# Altium project PCB_Project2.PrjPCB
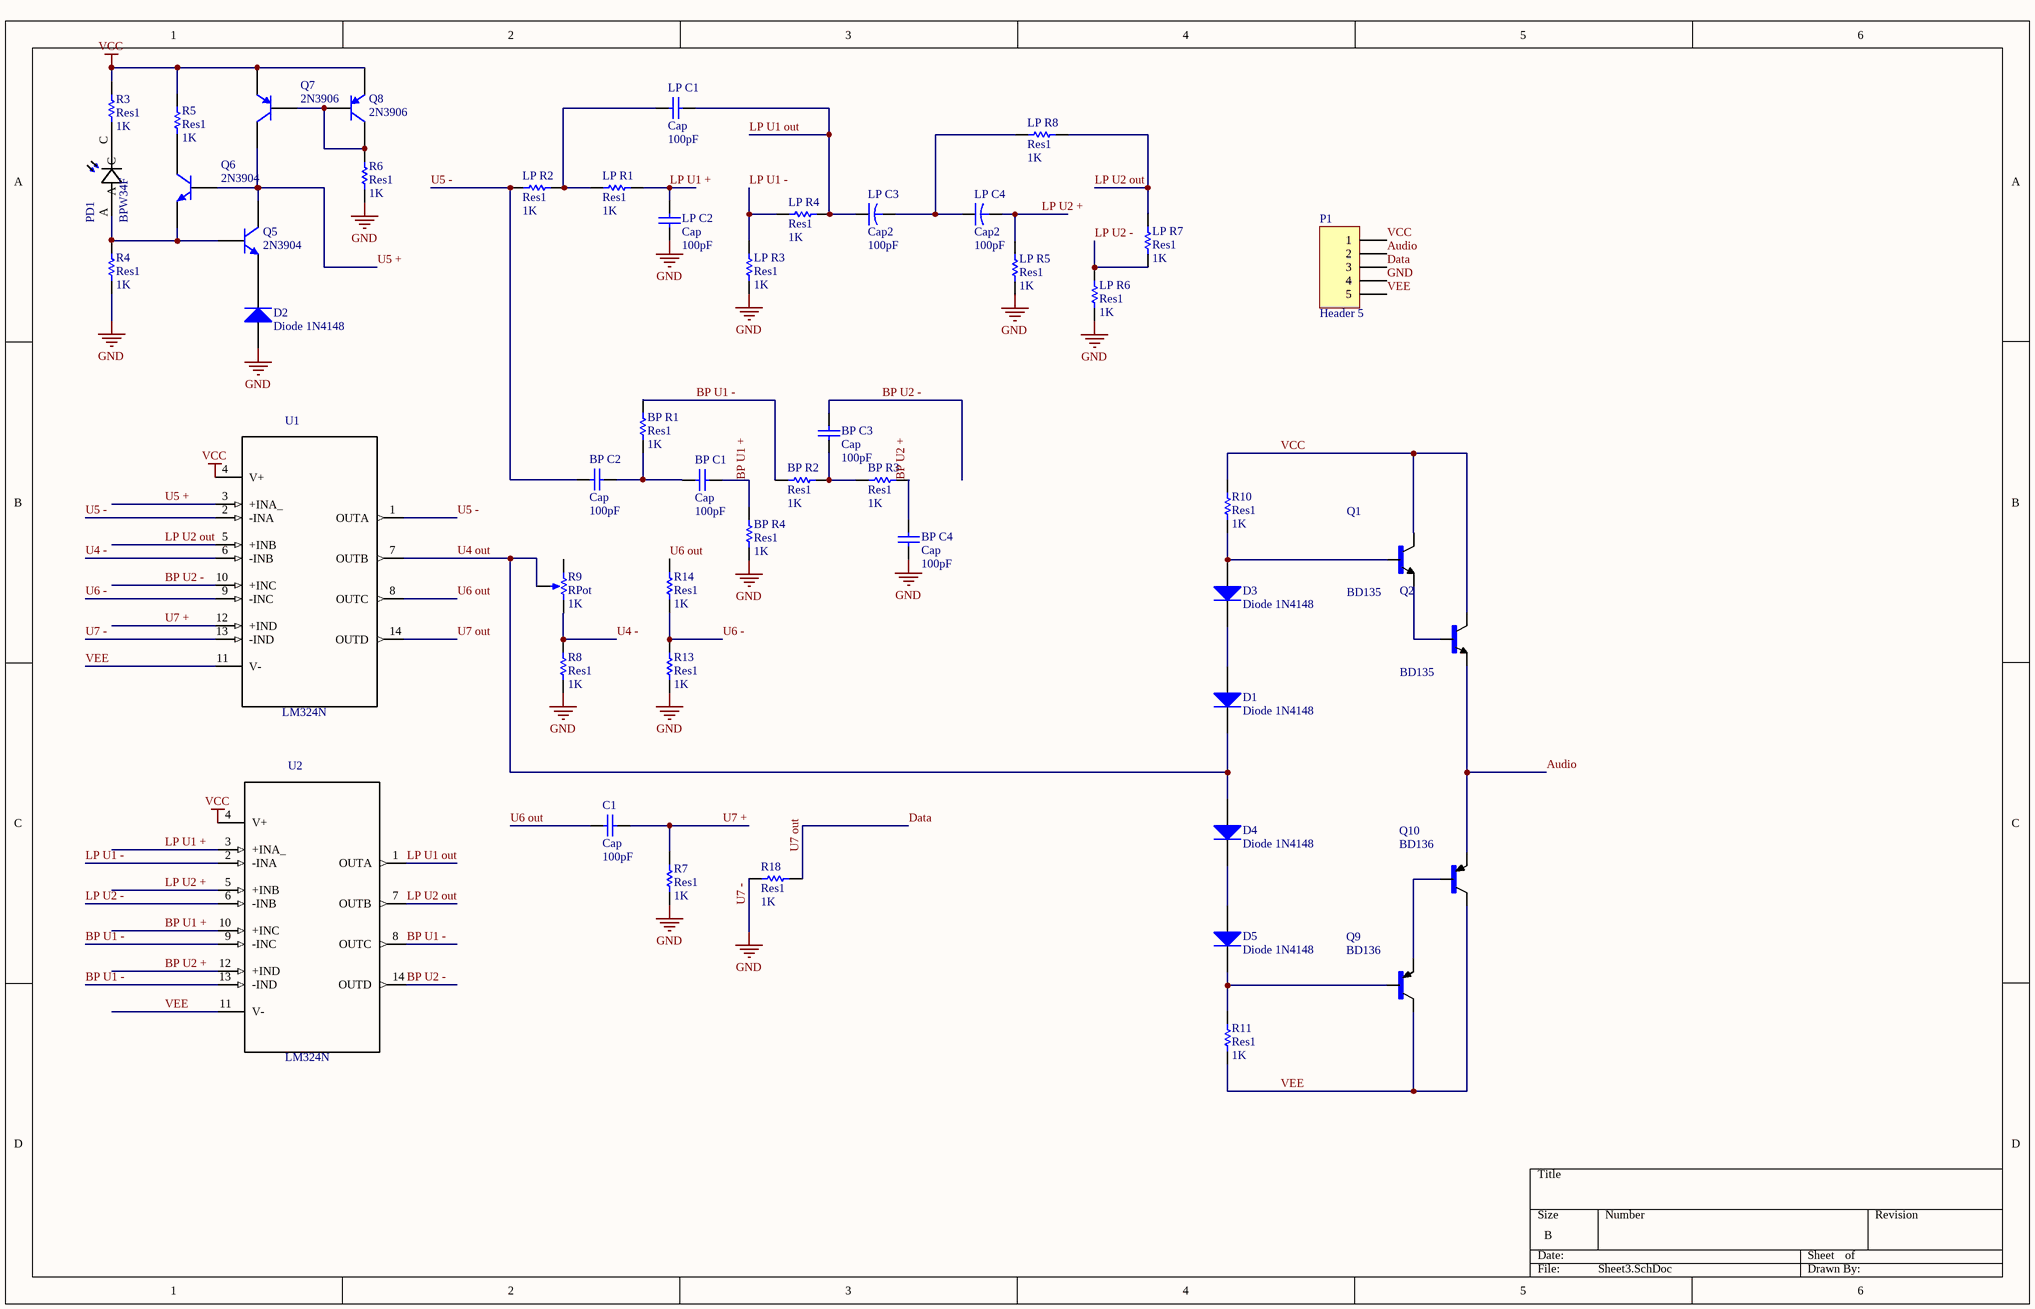
[diagram p0: Sheet3.SchDoc]
1 sheet, 50 parts. Net scope: global (net labels, ports and power ports of the same name join across sheets).
Board file: Reciever.PcbDoc

## Sheet Sheet3.SchDoc
size B

### Parts
BP_C1  Cap  value 100pF  [RAD-0.3]
BP_C2  Cap  value 100pF  [RAD-0.3]
BP_C3  Cap  value 100pF  [RAD-0.3]
BP_C4  Cap  value 100pF  [RAD-0.3]
BP_R1  Res1  value 1K  [AXIAL-0.3]
BP_R2  Res1  value 1K  [AXIAL-0.3]
BP_R3  Res1  value 1K  [AXIAL-0.3]
BP_R4  Res1  value 1K  [AXIAL-0.3]
C1  Cap  value 100pF  [RAD-0.3]
D1  Diode 1N4148  [DO-35]
D2  Diode 1N4148  [DO-35]
D3  Diode 1N4148  [DO-35]
D4  Diode 1N4148  [DO-35]
D5  Diode 1N4148  [DO-35]
LP_C1  Cap  value 100pF  [RAD-0.3]
LP_C2  Cap  value 100pF  [RAD-0.3]
LP_C3  Cap2  value 100pF  [CAPR5-4X5]
LP_C4  Cap2  value 100pF  [CAPR5-4X5]
LP_R1  Res1  value 1K  [AXIAL-0.3]
LP_R2  Res1  value 1K  [AXIAL-0.3]
LP_R3  Res1  value 1K  [AXIAL-0.3]
LP_R4  Res1  value 1K  [AXIAL-0.3]
LP_R5  Res1  value 1K  [AXIAL-0.3]
LP_R6  Res1  value 1K  [AXIAL-0.3]
LP_R7  Res1  value 1K  [AXIAL-0.3]
LP_R8  Res1  value 1K  [AXIAL-0.3]
P1  Header 5  [HDR1X5]
PD1  BPW34F  [*PHODET_BPW34F_BPW34F(Primary)]
Q1  BD135  [*TO229P780X300X2000-3]
Q2  BD135  [*TO229P780X300X2000-3]
Q5  2N3904  [TO-92A]
Q6  2N3904  [TO-92A]
Q7  2N3906  [TO-92A]
Q8  2N3906  [TO-92A]
Q9  BD136  [*BD136]
Q10  BD136  [*BD136]
R3  Res1  value 1K  [AXIAL-0.3]
R4  Res1  value 1K  [AXIAL-0.3]
R5  Res1  value 1K  [AXIAL-0.3]
R6  Res1  value 1K  [AXIAL-0.3]
R7  Res1  value 1K  [AXIAL-0.3]
R8  Res1  value 1K  [AXIAL-0.3]
R9  RPot  value 1K  [VR5]
R10  Res1  value 1K  [AXIAL-0.3]
R11  Res1  value 1K  [AXIAL-0.3]
R13  Res1  value 1K  [AXIAL-0.3]
R14  Res1  value 1K  [AXIAL-0.3]
R18  Res1  value 1K  [AXIAL-0.3]
U1  LM324N  [*DIP254P762X508-14]
U2  LM324N  [*DIP254P762X508-14]

### Nets
GND: BP_C4.2 BP_R4.1 D2.1(A) LP_C2.1 LP_R3.1 LP_R5.2 LP_R6.2 P1.4 R4.1 R6.1 R7.1 R8.1 R13.1 R18.2 U1.13(-IND)  [also labelled U7 -]
VCC: P1.1 Q1.2(C) Q2.2(C) Q7.1(E) Q8.1(E) R3.2 R5.2 R10.2 U1.4(V+) U2.4(V+)
Audio: P1.2 Q2.1(E) Q10.1(E)
BP U1 +: BP_C1.1 BP_R4.2 U2.10(+INC)
BP U1 -: BP_R1.2 BP_R2.2 U2.8(OUTC) U2.9(-INC) U2.13(-IND)
BP U2 +: BP_C4.1 BP_R3.1 U2.12(+IND)
BP U2 -: BP_C3.1 U1.10(+INC) U2.14(OUTD)
Data: P1.3 R18.1 U1.14(OUTD)  [also labelled U7 out]
LP U1 +: LP_C2.2 LP_R1.2 U2.3(+INA_)
LP U1 -: LP_R3.2 LP_R4.2 U2.2(-INA)
LP U1 out: LP_C1.2 LP_C3.1 LP_R4.1 U2.1(OUTA)
LP U2 +: LP_C4.2 LP_R5.1 U2.5(+INB)
LP U2 -: LP_R6.1 LP_R7.2 U2.6(-INB)
LP U2 out: LP_R7.1 LP_R8.2 U1.5(+INB) U2.7(OUTB)
U4 -: R8.2 R9.2(BOT) U1.6(-INB)
U4 out: D1.2(K) D4.1(A) R9.3(TAP) U1.7(OUTB)
U5 +: Q5.3(C) Q6.2(B) Q7.3(C) U1.3(+INA_)
U5 -: BP_C2.2 LP_R2.1 U1.1(OUTA) U1.2(-INA)
U6 -: R13.2 R14.1 U1.9(-INC)
U6 out: C1.1 R14.2 U1.8(OUTC)
U7 +: C1.2 R7.2 U1.12(+IND)
VEE: P1.5 Q9.2(C) Q10.2(C) R11.1 U1.11(V-) U2.11(V-)
NetBP_C1_2: BP_C1.2 BP_C2.1 BP_R1.1
NetBP_C3_2: BP_C3.2 BP_R2.1 BP_R3.2
NetD1_1: D1.1(A) D3.2(K)
NetD2_2: D2.2(K) Q5.1(E)
NetD3_1: D3.1(A) Q1.3(B) R10.1
NetD4_2: D4.2(K) D5.1(A)
NetD5_2: D5.2(K) Q9.3(B) R11.2
NetLP_C1_1: LP_C1.1 LP_R1.1 LP_R2.2
NetLP_C3_2: LP_C3.2 LP_C4.1 LP_R8.1
NetPD1_A: PD1.A Q5.2(B) Q6.1(E) R4.2
NetPD1_C: PD1.C R3.1
NetQ1_1: Q1.1(E) Q2.3(B)
NetQ6_3: Q6.3(C) R5.1
NetQ7_2: Q7.2(B) Q8.2(B) Q8.3(C) R6.2
NetQ9_1: Q9.1(E) Q10.3(B)

Not connected (* = marked no-connect by the designer): R9 1(TOP)

### Library data of the parts
BP_C1-BP_C4 C1 LP_C1 LP_C2 = Cap: Capacitor; Published: 8-Jun-2000; LatestRevisionDate: 17-Jul-2002; LatestRevisionNote: Re-released for DXP Platform.; PackageReference: RAD-0.3; Publisher: Altium Limited; PackageDescription: Radial Cap, Thru-Hole; 2 Leads; 0.3 in Pin Spacing
BP_R1-BP_R4 LP_R1-LP_R8 R3-R8 R10 R11 R13 R14 R18 = Res1: Resistor; Published: 8-Jun-2000; LatestRevisionDate: 17-Jul-2002; LatestRevisionNote: Re-released for DXP Platform.; PackageReference: AXIAL-0.3; Publisher: Altium Limited; PackageDescription: Axial Device, Thru-Hole; 2 Leads; 0.3 in Pin Spacing
D1-D5 = Diode 1N4148: High Conductance Fast Diode; Published: 8-Jun-2000; LatestRevisionDate: 17-Jul-2002; LatestRevisionNote: Re-released for DXP Platform.; DatasheetVersion: 1997; PackageReference: DO-35; Publisher: Altium Limited; PackageDescription: Diode, Axial; Body 3.8 x 1.9 mm (LxDia. max), Lead Dia. 0.53 mm (max); Code_JEDEC: DO-204-AH; ComponentLink1Description: Manufacturer Link; ComponentLink1URL: http://www.fairchildsemi.com/; ComponentLink2Description: Datasheet; ComponentLink2URL: http://www.fairchildsemi.com/ds/1N%2F1N4148.pdf
LP_C3 LP_C4 = Cap2: Capacitor; Published: 23-Sep-2002; PackageReference: CAPR5-4X5; Publisher: Altium Limited; PackageDescription: Capacitor; 2 Leads
P1 = Header 5: Header, 5-Pin; LatestRevisionDate: 17-Jul-2002; LatestRevisionNote: Re-released for DXP Platform.; Publisher: Altium Limited
PD1 = BPW34F: Photodiode PIN Chip 950nm 0.59A/W Sensitivity Automotive 2-Pin PDIL; MF: OSRAM Opto; Price: None; Package: DIP-2 OSRAM; MP: BPW34F; SnapEDA_Link: https://www.snapeda.com/parts/BPW34F/OSRAM%20Opto%20Semiconductors%20Inc./view-part/?ref=snap; Availability: Unavailable; Value: *
Q1 Q2 = BD135: Trans GP BJT NPN 45V 1.5A 3-Pin TO-126; MF: ON Semiconductor; Price: None; Package: TO-126-3 NXP Semiconductors; MP: BD135; SnapEDA_Link: https://www.snapeda.com/parts/BD135/ON%20Semiconductor/view-part/?ref=snap; Availability: Unavailable; Value: *
Q5 Q6 = 2N3904: NPN General Purpose Amplifier; Published: 8-Jun-2000; LatestRevisionDate: 15-Jan-2003; LatestRevisionNote: PCB Footprint 'BCY-W3/D4.7' replaced; DatasheetVersion: 1997; PackageVersion: Sep-1998; PackageReference: TO-92A; Publisher: Altium Limited; PackageDescription: TO, Flat Index; 3 In-Line, Axial Leads; Body Dia. 4.5mm; Leads 0.51 x 0.48 mm (max); ComponentLink1Description: Manufacturer Link; ComponentLink1URL: http://www.fairchildsemi.com/; ComponentLink2Description: Datasheet; ComponentLink2URL: http://www.fairchildsemi.com/ds/2N%2F2N3904.pdf
Q7 Q8 = 2N3906: PNP General Purpose Amplifier; Published: 8-Jun-2000; LatestRevisionDate: 15-Jan-2003; LatestRevisionNote: PCB Footprint 'BCY-W3/D4.7' replaced; DatasheetVersion: 1997; PackageVersion: Sep-1998; PackageReference: TO-92A; Publisher: Altium Limited; PackageDescription: TO, Flat Index; 3 In-Line, Axial Leads; Body Dia. 4.5mm; Leads 0.51 x 0.48 mm (max); ComponentLink1Description: Manufacturer Link; ComponentLink1URL: http://www.fairchildsemi.com/; ComponentLink2Description: Datasheet; ComponentLink2URL: http://www.fairchildsemi.com/ds/2N%2F2N3906.pdf
Q9 Q10 = BD136: Bipolar Transistor, PNP, -45V; MF: ON Semiconductor; Price: None; Package: TO-126 Multicomp; MP: BD136; SnapEDA_Link: https://www.snapeda.com/parts/BD136/ON%20Semiconductor/view-part/?ref=snap; Availability: Unavailable; Value: *
R9 = RPot: Potentiometer; Sim Note: Enter the Resistance value and the set point into parameter fields.; Set Position: 0.5; Published: 8-Jun-2000; LatestRevisionDate: 17-Jul-2002; LatestRevisionNote: Re-released for DXP Platform.; PackageReference: VR5; Publisher: Altium Limited; PackageDescription: Variable Resistor, Thru-Hole; 3 Leads
U1 U2 = LM324N: Ic Opamp Gp 1.2mhz 14dip; MF: ON Semiconductor; Package: PDIP-14 Motorola; MP: LM324N; Price: None; Availability: Unavailable; SnapEDA_Link: https://www.snapeda.com/parts/LM324N/ON%20Semiconductor/view-part/?ref=snap; Value: *